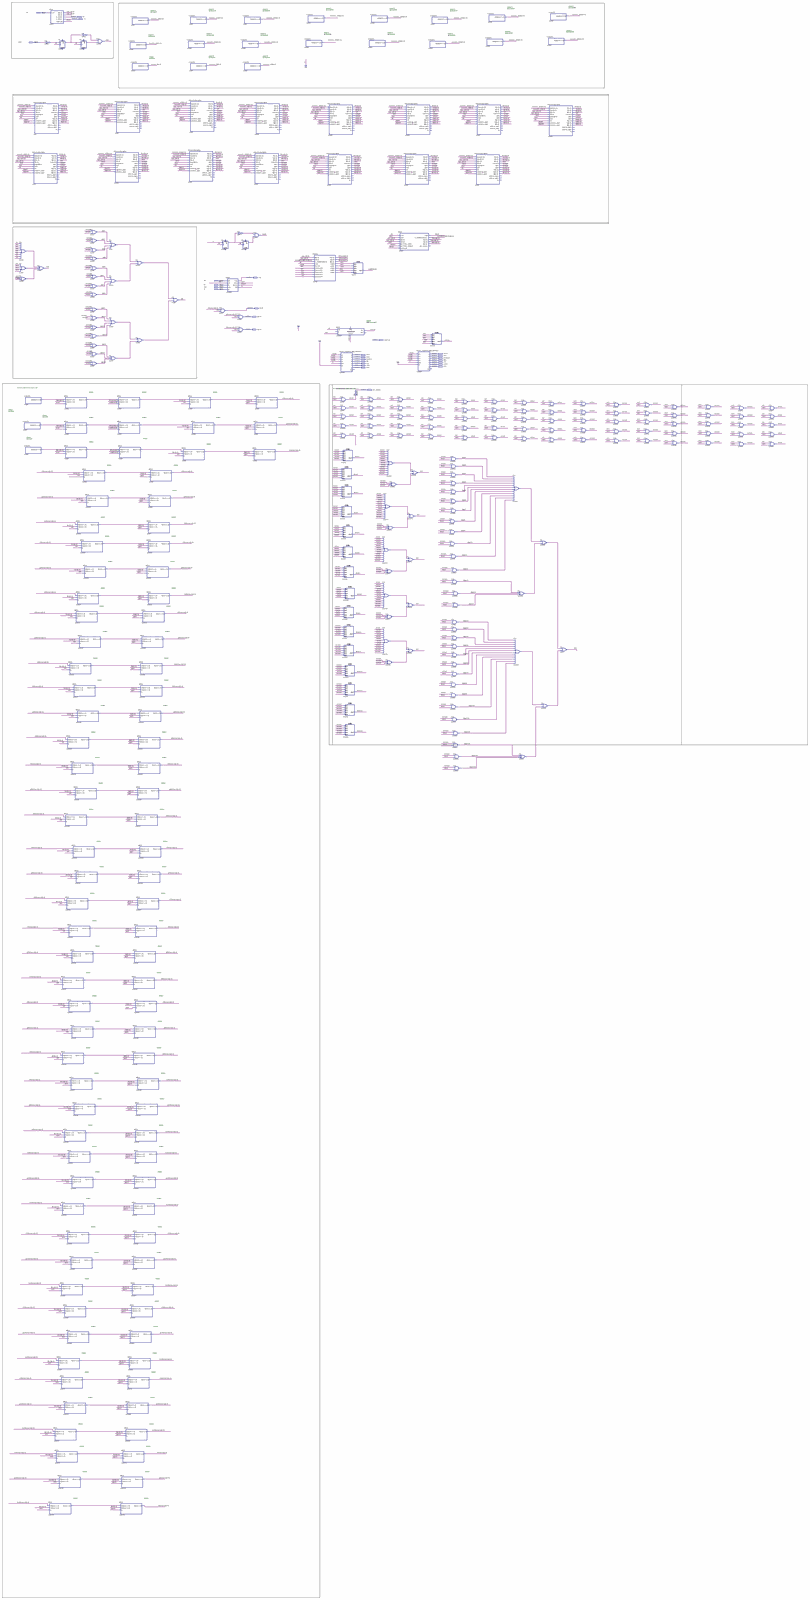
[diagram p0: schematic sheet, whole]
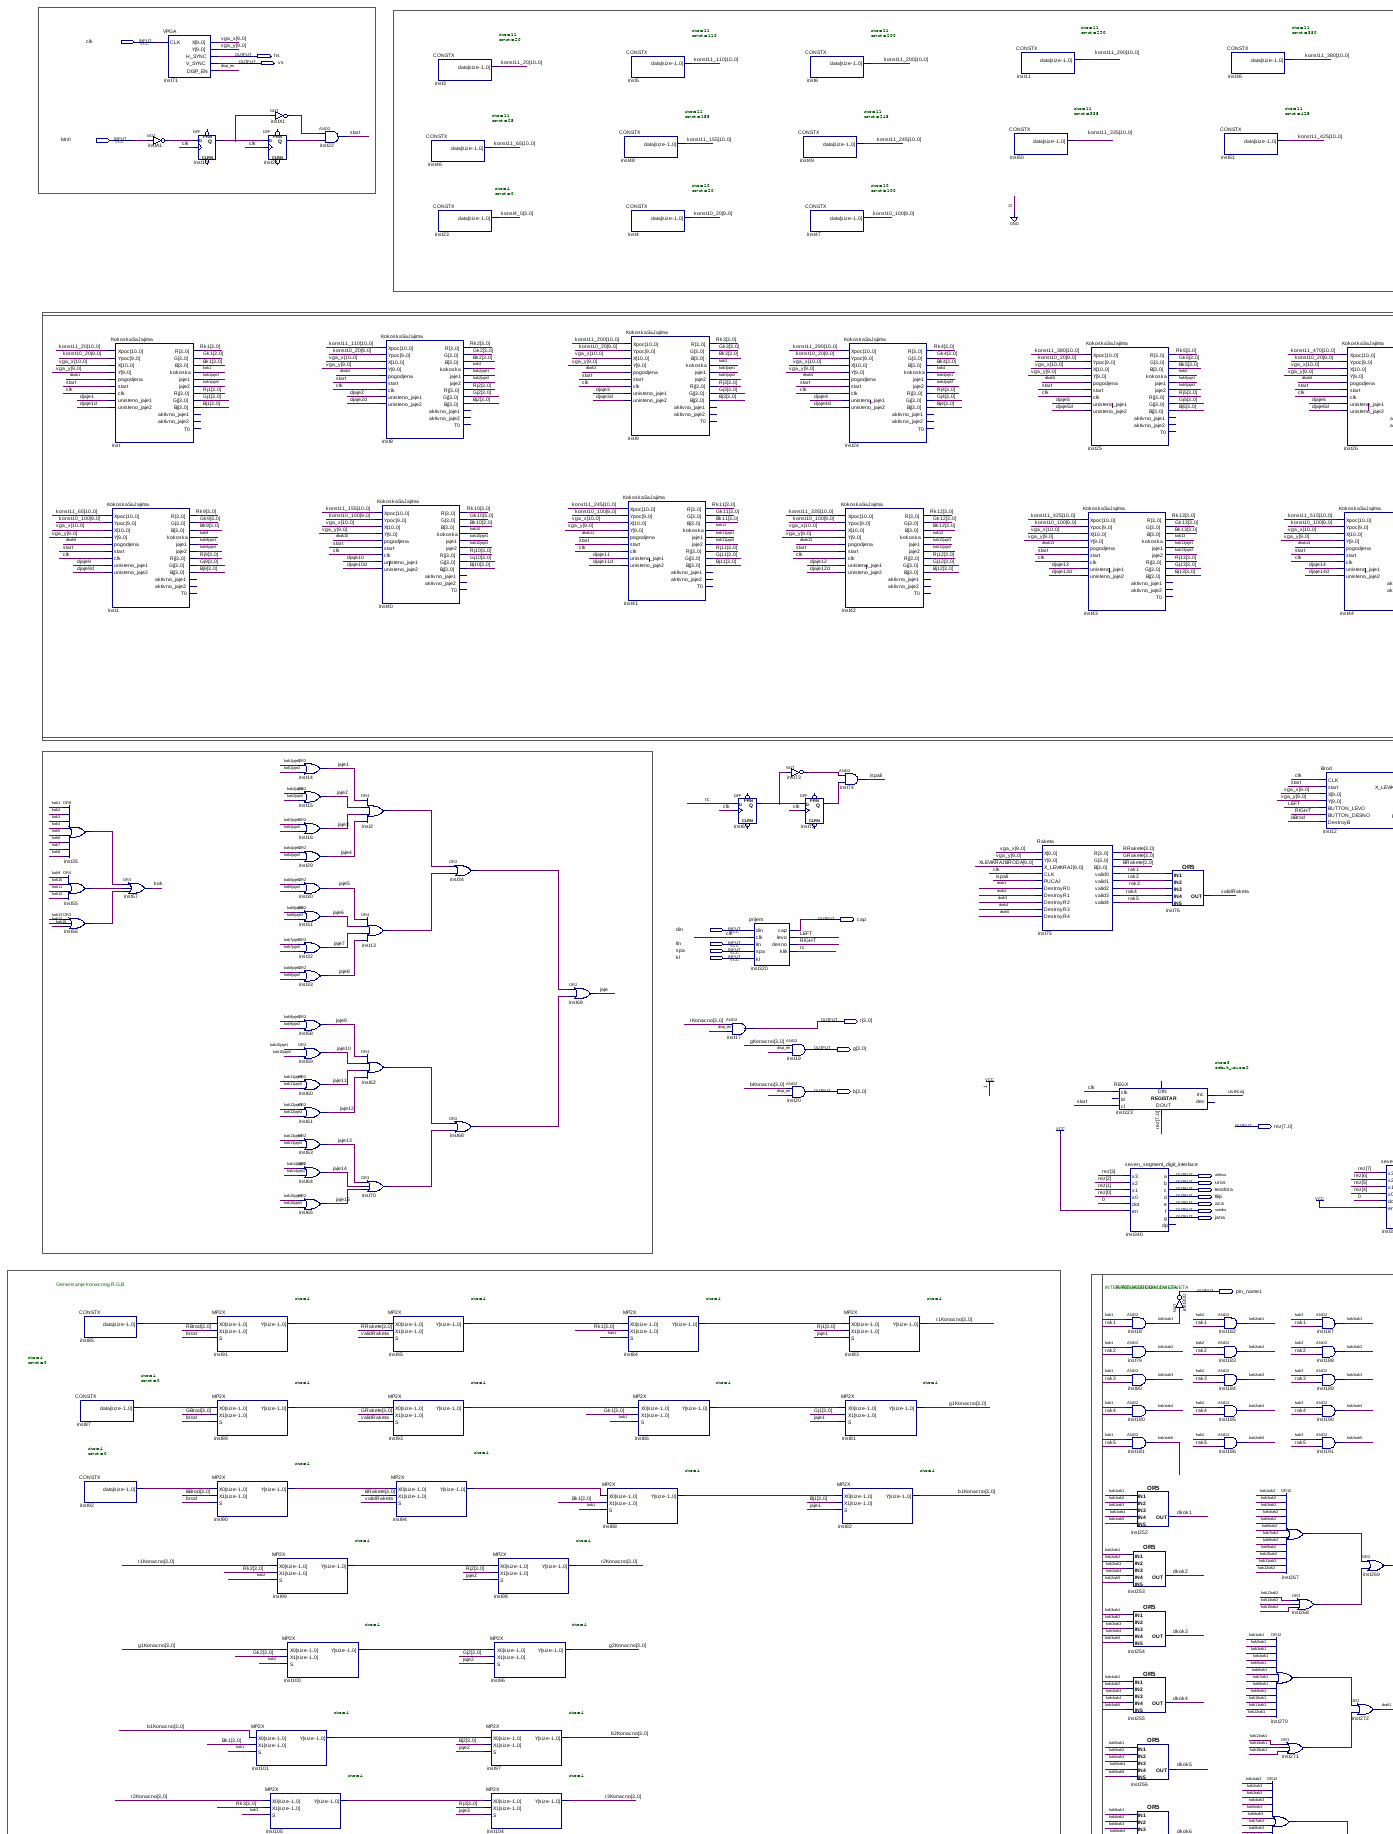
[diagram p1: schematic sheet, upper left part]
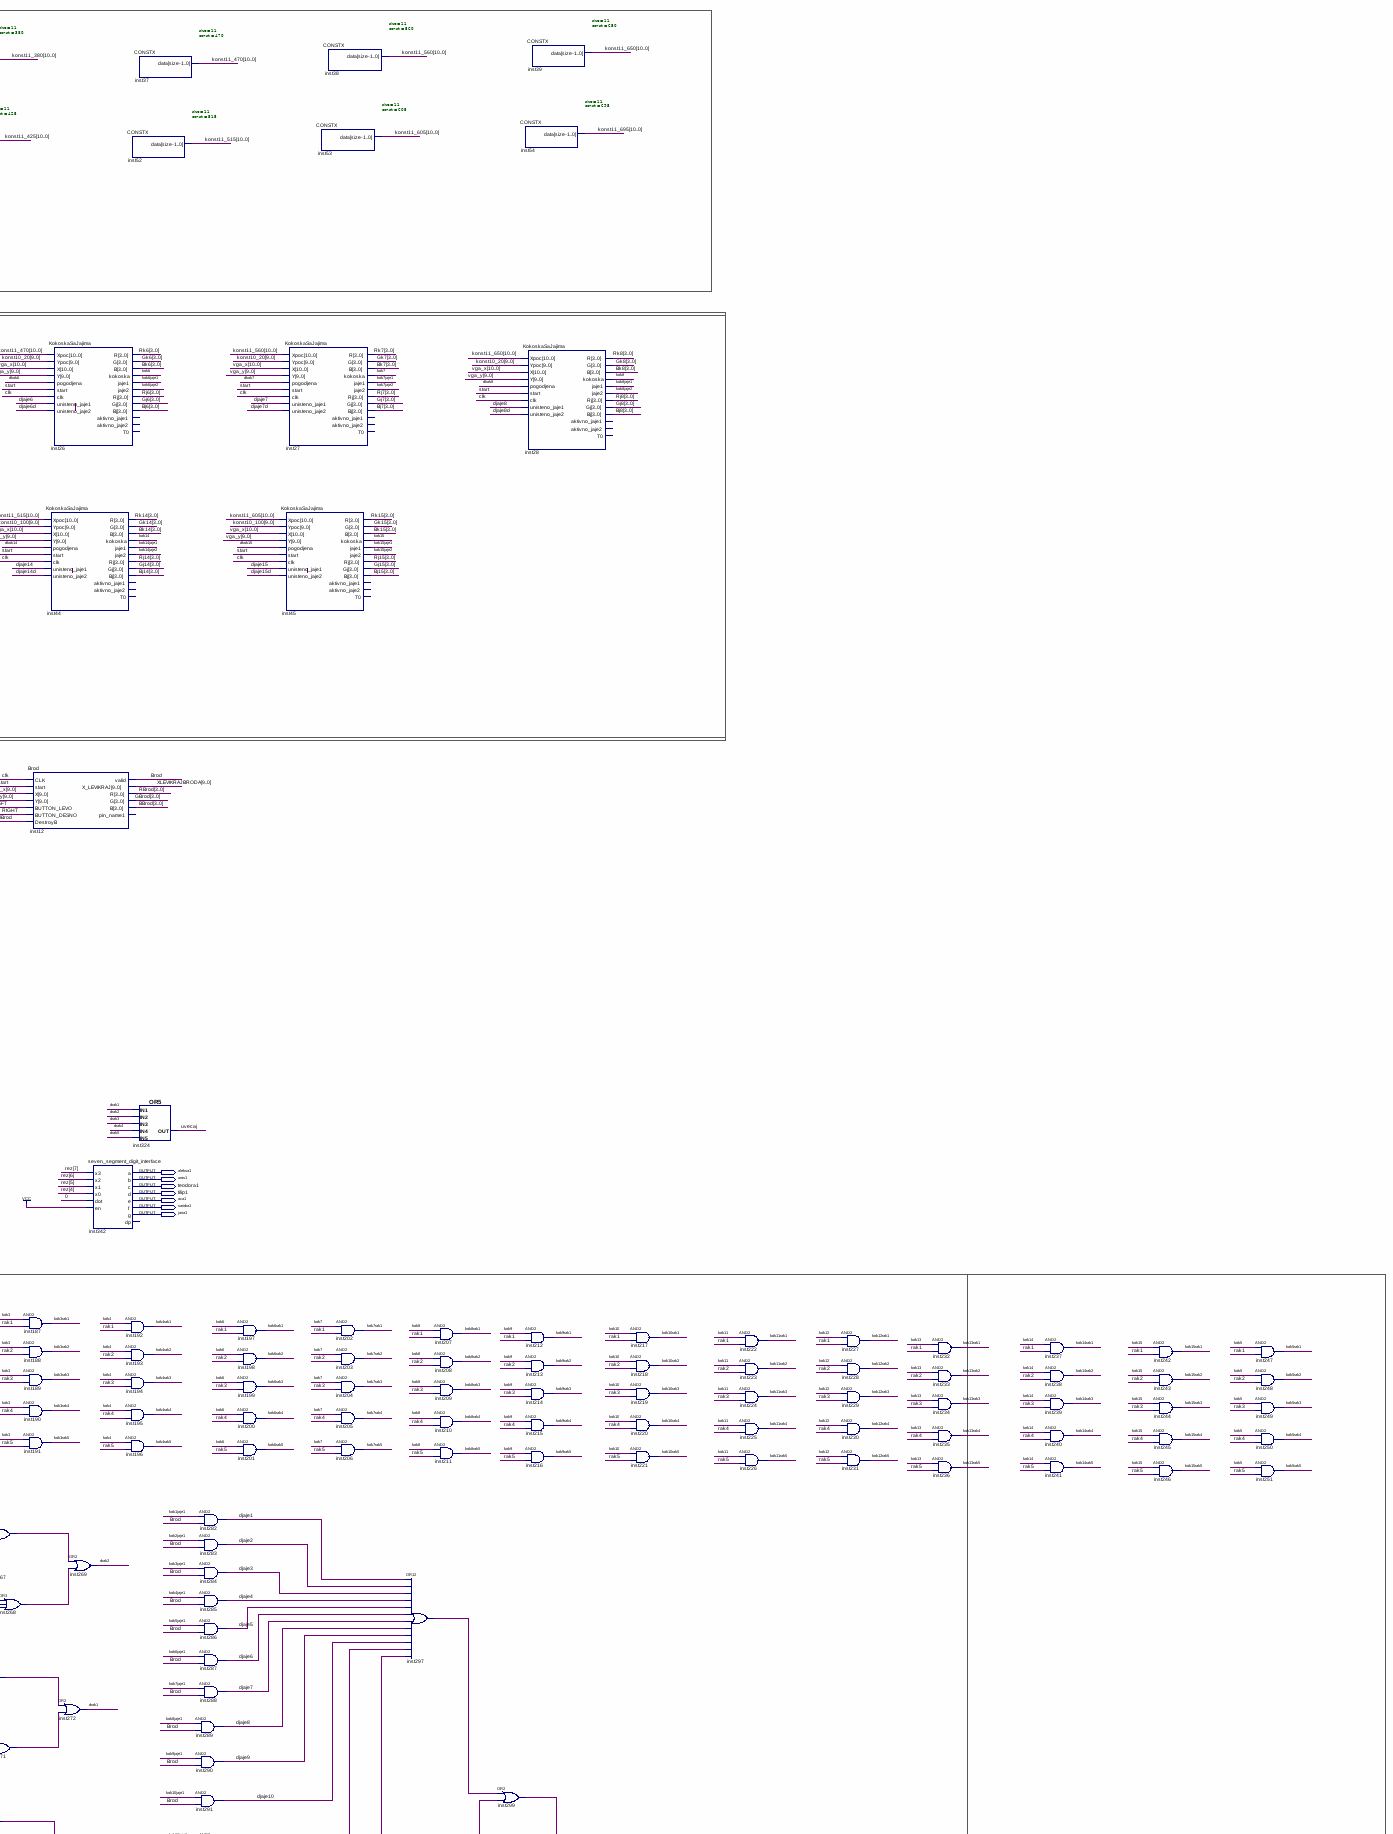
[diagram p2: schematic sheet, upper right part]
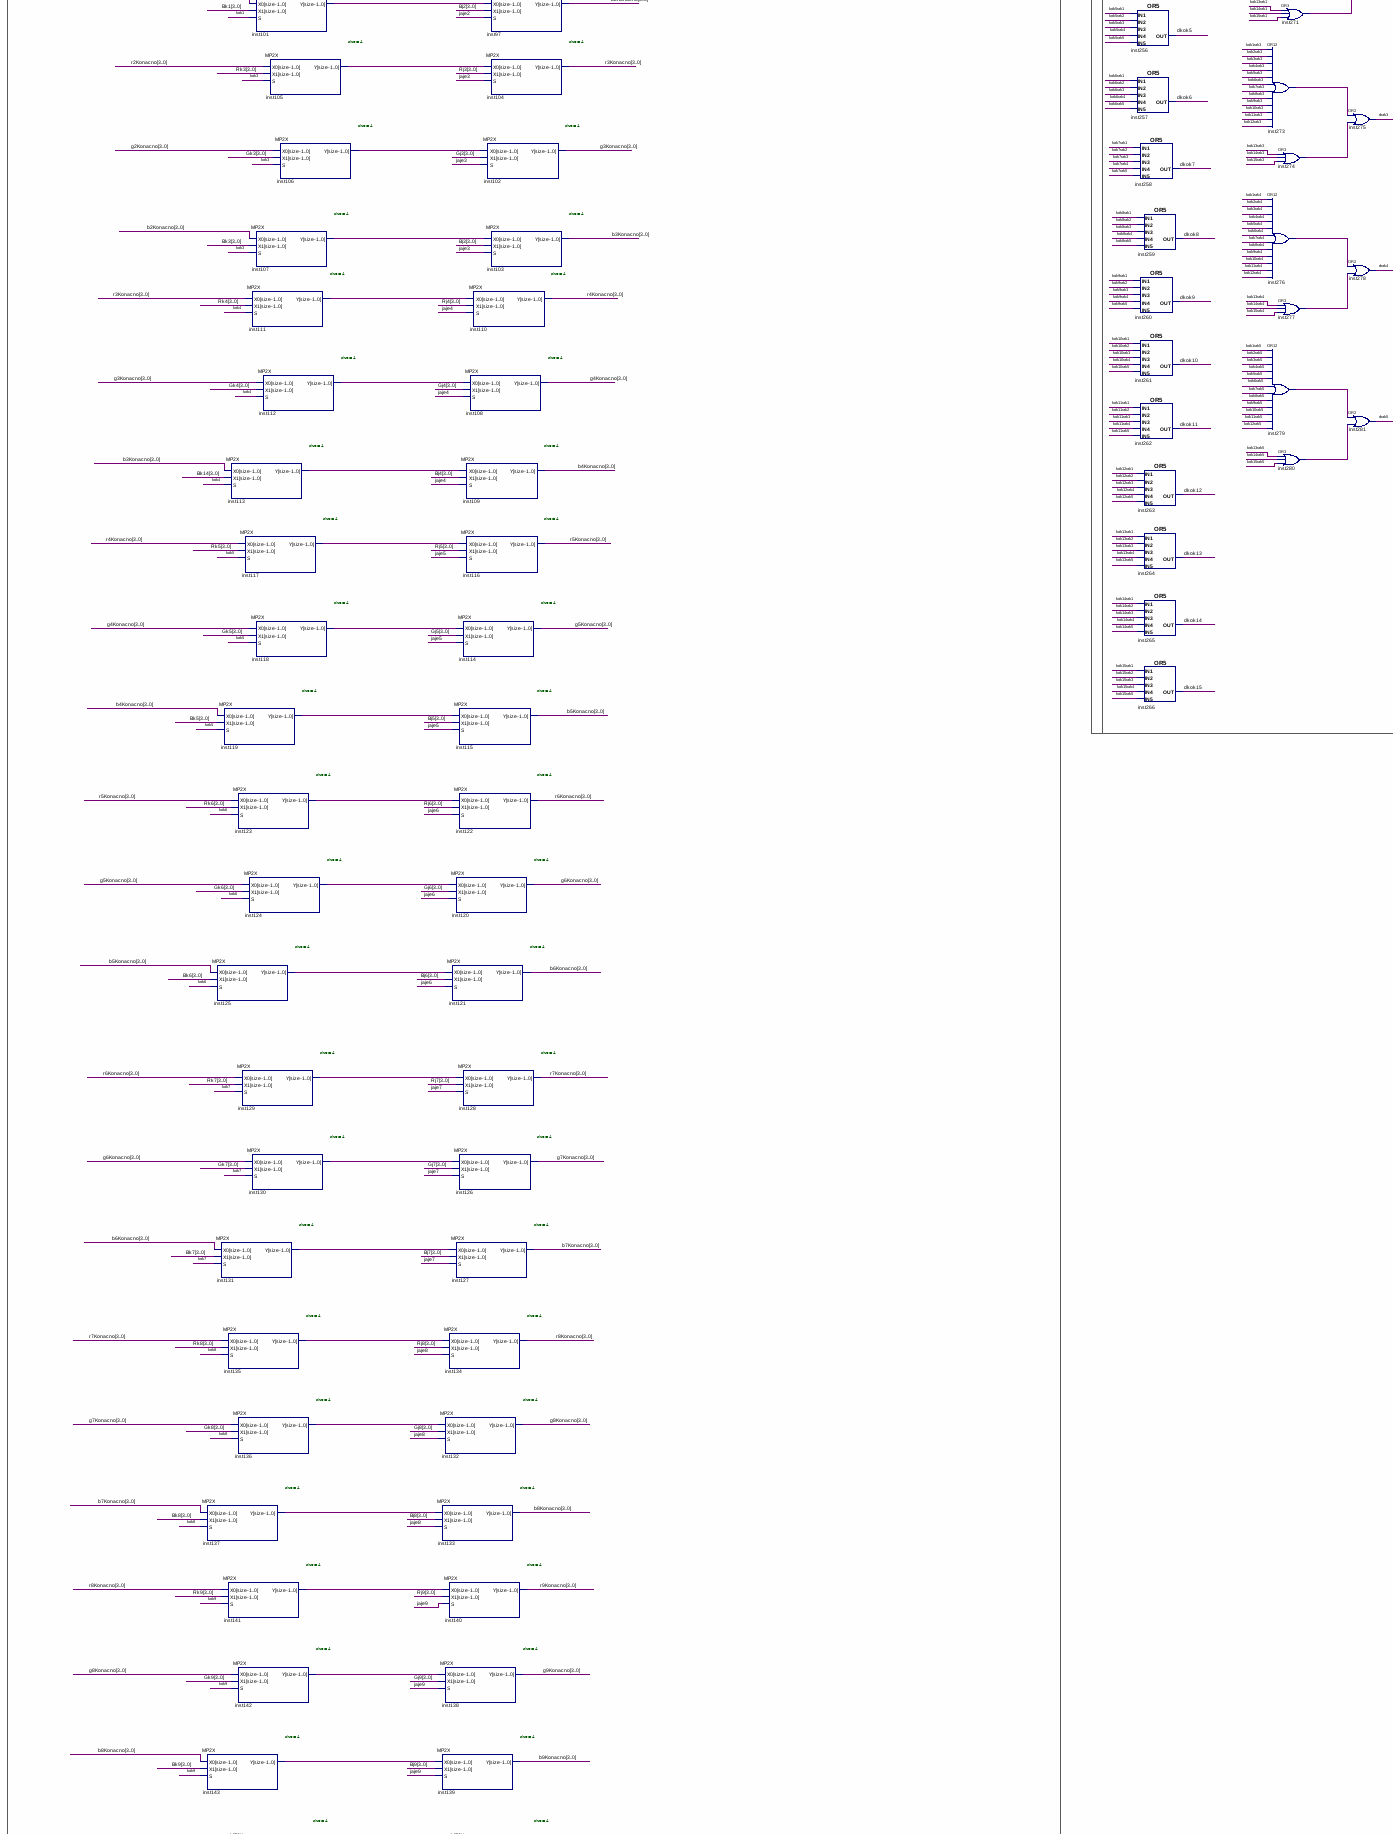
[diagram p3: schematic sheet, middle left part]
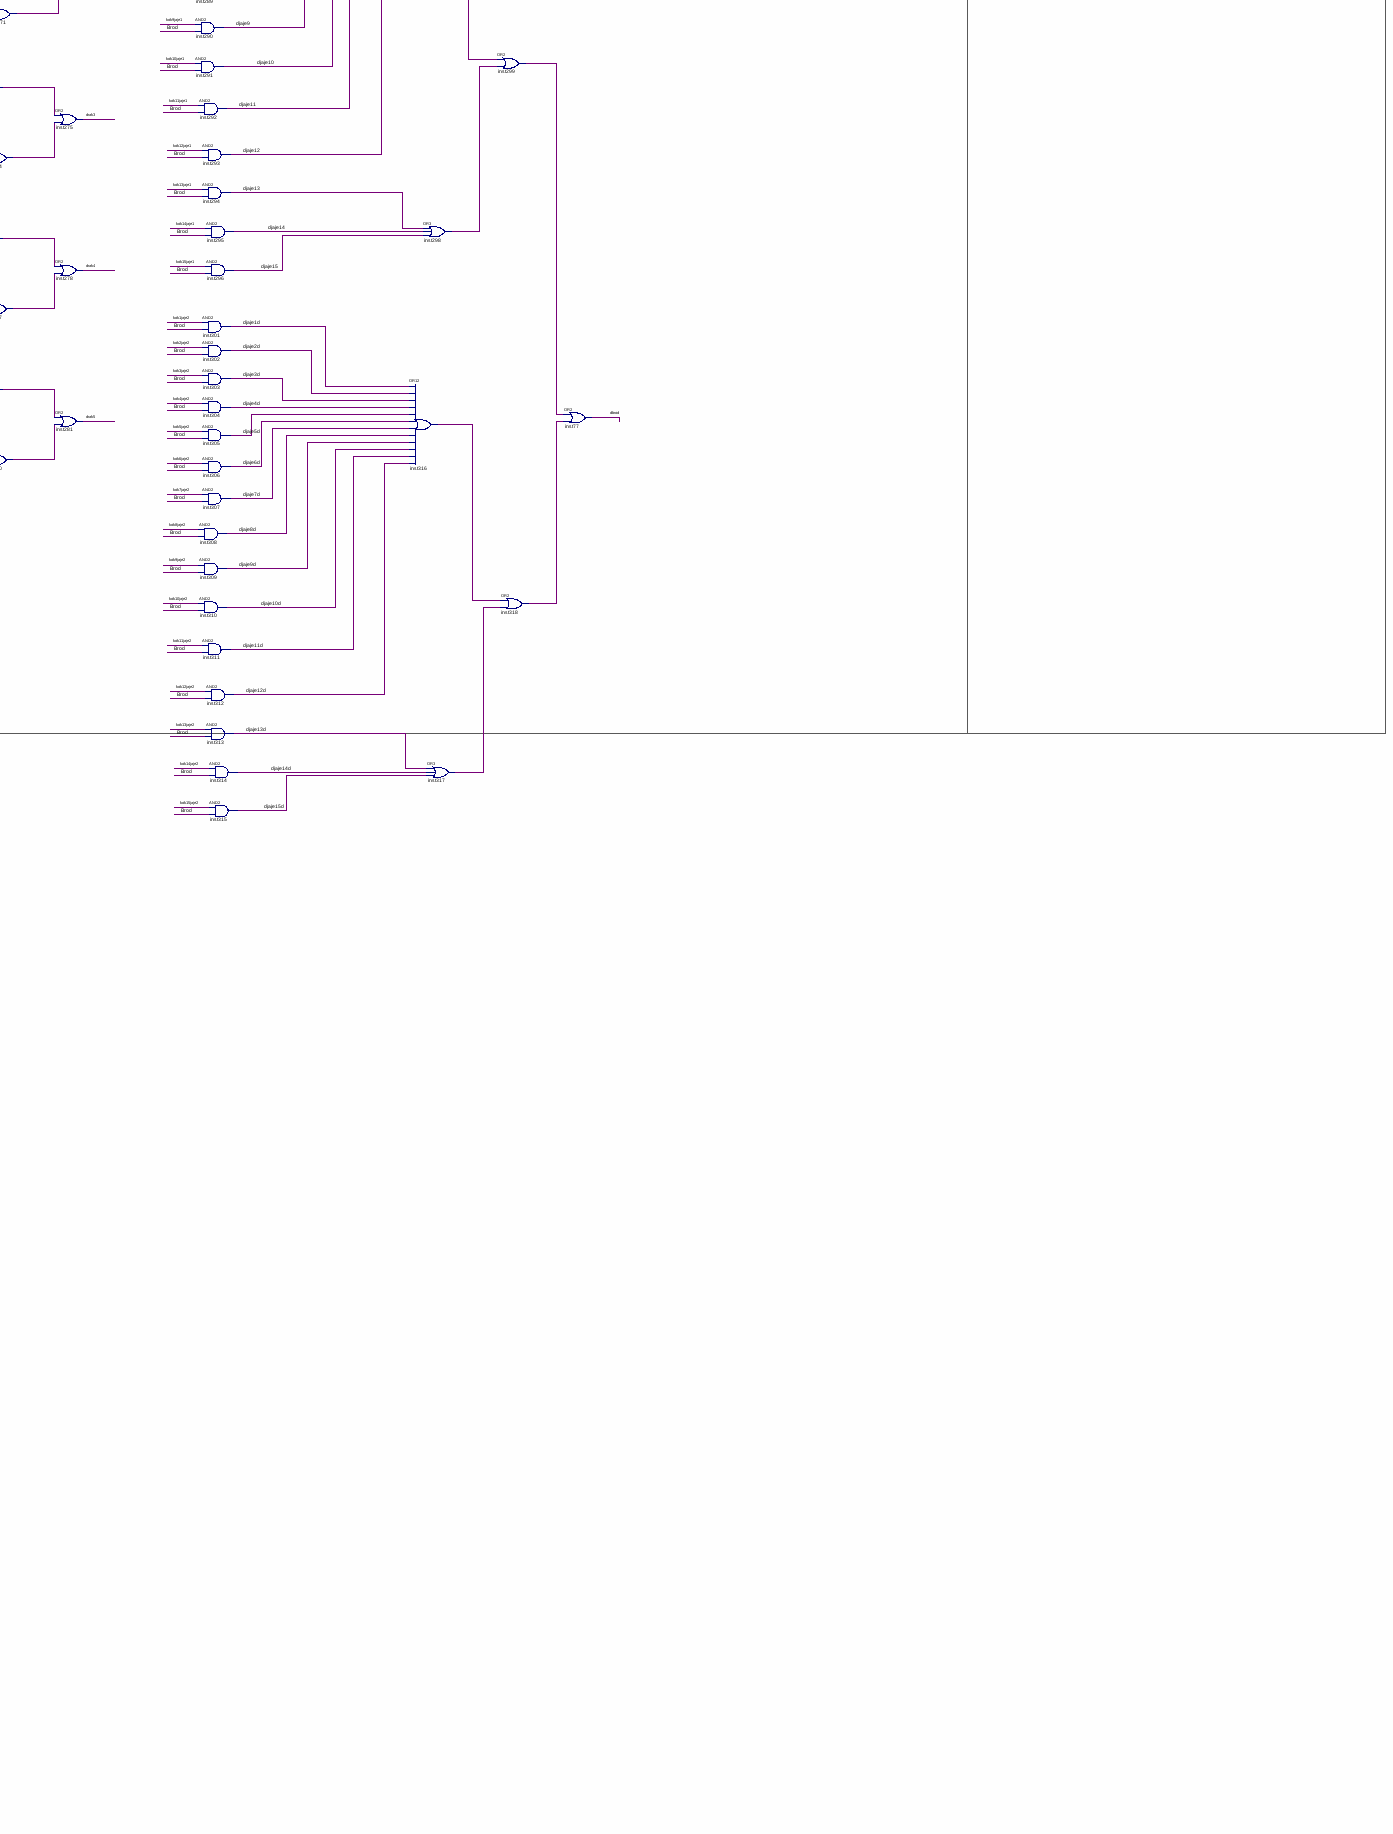
[diagram p4: schematic sheet, middle right part]
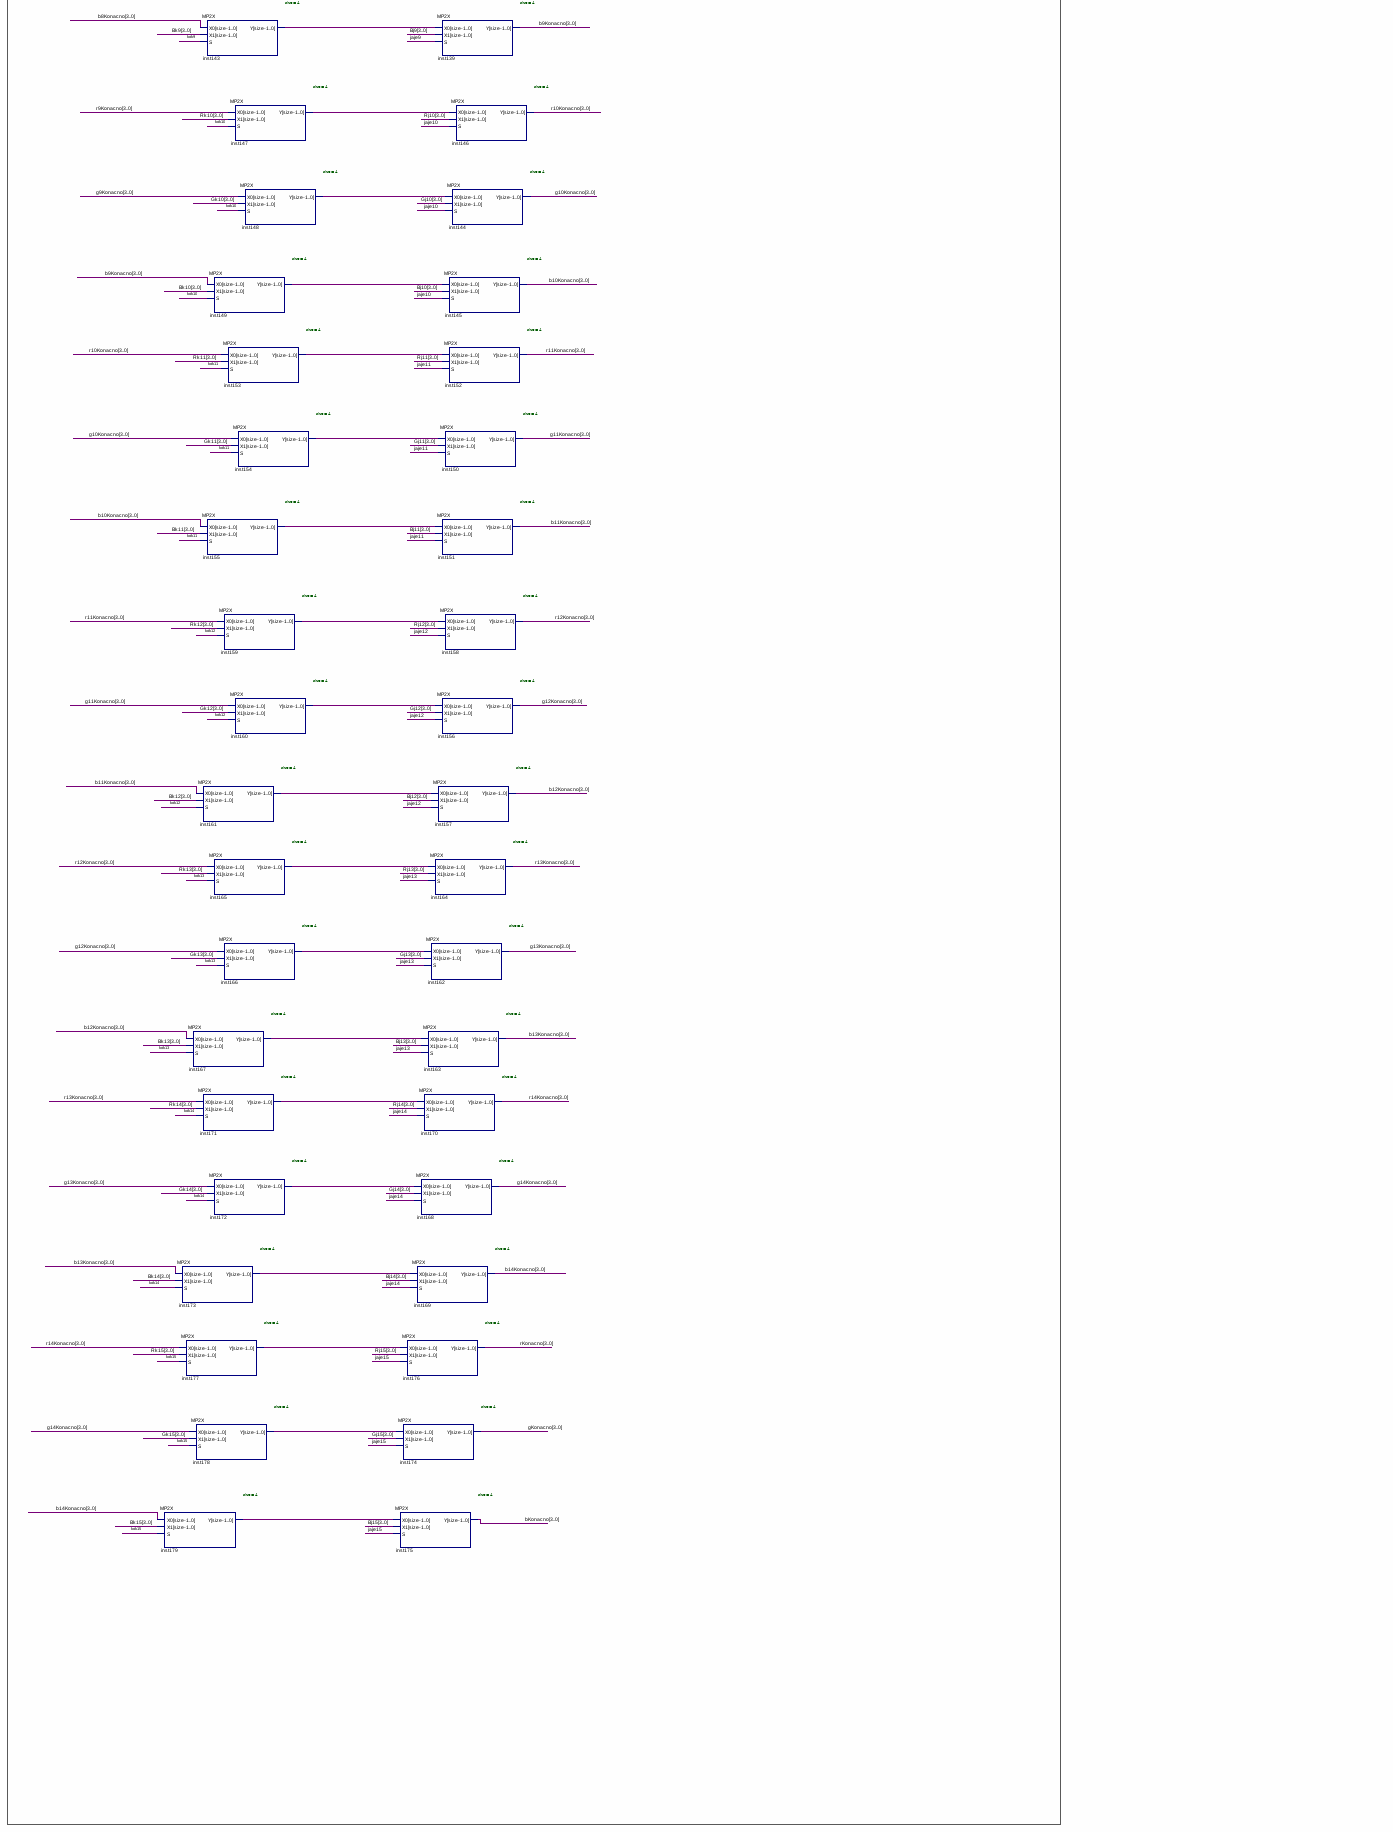
[diagram p5: schematic sheet, lower left part]
// Quartus schematic main.bdf as structural Verilog: 323 symbols, 28 pins
module main (
  input  clk,
  input  btn0,
  input  din,
  input  lin,
  input  spa,
  input  kl,
  output hs,
  output vs,
  output cap,
  output [3:0] r,
  output [3:0] g,
  output [3:0] b,
  output [7:0] rez,
  output aleksa1,
  output aleksa,
  output uros1,
  output uros,
  output teodora1,
  output teodora,
  output filip1,
  output filip,
  output aca1,
  output aca,
  output sandra1,
  output sandra,
  output jana1,
  output jana,
  output pin_name1
);

  wire brod, dBrod, disp_en, djaje1, djaje1d, djaje2, djaje2d, djaje3, djaje3d, djaje4, djaje4d, djaje5,
       djaje5d, djaje6, djaje6d, djaje7, djaje7d, djaje8, djaje8d, djaje9, djaje9d, djaje10, djaje10d,
       djaje11, djaje11d, djaje12, djaje12d, djaje13, djaje13d, djaje14, djaje14d, djaje15, djaje15d, dkok1,
       dkok2, dkok3, dkok4, dkok5, dkok6, dkok7, dkok8, dkok9, dkok10, dkok11, dkok12, dkok13, dkok14,
       dkok15, drak1, drak2, drak3, drak4, drak5, inst2_out, inst10_q, inst13_out, inst21_q, inst34_out,
       inst35_out, inst55_out, inst56_out, inst62_out, inst67_q, inst68_out, inst70_out, inst72_q,
       inst73_out, inst267_out, inst268_out, inst270_out, inst271_out, inst273_out, inst274_out, inst276_out,
       inst277_out, inst279_out, inst280_out, inst297_out, inst298_out, inst299_out, inst316_out,
       inst317_out, inst318_out, instA1_out, instX1_out, ispali, jaje, jaje1, jaje2, jaje3, jaje4, jaje5,
       jaje6, jaje7, jaje8, jaje9, jaje10, jaje11, jaje12, jaje13, jaje14, jaje15, kok, kok1, kok1jaje1,
       kok1jaje2, kok1rak1, kok1rak2, kok1rak3, kok1rak4, kok1rak5, kok2, kok2jaje1, kok2jaje2, kok2rak1,
       kok2rak2, kok2rak3, kok2rak4, kok2rak5, kok3, kok3jaje1, kok3jaje2, kok3rak1, kok3rak2, kok3rak3,
       kok3rak4, kok3rak5, kok4, kok4jaje1, kok4jaje2, kok4rak1, kok4rak2, kok4rak3, kok4rak4, kok4rak5,
       kok5, kok5jaje1, kok5jaje2, kok5rak1, kok5rak2, kok5rak3, kok5rak4, kok5rak5, kok6, kok6jaje1,
       kok6jaje2, kok6rak1, kok6rak2, kok6rak3, kok6rak4, kok6rak5, kok7, kok7jaje1, kok7jaje2, kok7rak1,
       kok7rak2, kok7rak3, kok7rak4, kok7rak5, kok8, kok8jaje1, kok8jaje2, kok8rak1, kok8rak2, kok8rak3,
       kok8rak4, kok8rak5, kok9, kok9jaje1, kok9jaje2, kok9rak1, kok9rak2, kok9rak3, kok9rak4, kok9rak5,
       kok10, kok10jaje1, kok10jaje2, kok10rak1, kok10rak2, kok10rak3, kok10rak4, kok10rak5, kok11,
       kok11jaje1, kok11jaje2, kok11rak1, kok11rak2, kok11rak3, kok11rak4, kok11rak5, kok12, kok12jaje1,
       kok12jaje2, kok12rak1, kok12rak2, kok12rak3, kok12rak4, kok12rak5, kok13, kok13jaje1, kok13jaje2,
       kok13rak1, kok13rak2, kok13rak3, kok13rak4, kok13rak5, kok14, kok14jaje1, kok14jaje2, kok14rak1,
       kok14rak2, kok14rak3, kok14rak4, kok14rak5, kok15, kok15jaje1, kok15jaje2, kok15rak1, kok15rak2,
       kok15rak3, kok15rak4, kok15rak5, LEFT, rak1, rak2, rak3, rak4, rak5, rc, RIGHT, start, uvecaj,
       validRaketa;
  wire [3:0] b1Konacno, b2Konacno, b3Konacno, b4Konacno, b5Konacno, b6Konacno, b7Konacno, b8Konacno,
       b9Konacno, b10Konacno, b11Konacno, b12Konacno, b13Konacno, b14Konacno, BBrod, Bj1, Bj2, Bj3, Bj4, Bj5,
       Bj6, Bj7, Bj8, Bj9, Bj10, Bj11, Bj12, Bj13, Bj14, Bj15, Bk1, Bk2, Bk3, Bk4, Bk5, Bk6, Bk7, Bk8, Bk9,
       Bk10, Bk11, Bk12, Bk13, Bk14, Bk15, bKonacno, BRakete, g1Konacno, g2Konacno, g3Konacno, g4Konacno,
       g5Konacno, g6Konacno, g7Konacno, g8Konacno, g9Konacno, g10Konacno, g11Konacno, g12Konacno, g13Konacno,
       g14Konacno, GBrod, Gj1, Gj2, Gj3, Gj4, Gj5, Gj6, Gj7, Gj8, Gj9, Gj10, Gj11, Gj12, Gj13, Gj14, Gj15,
       Gk1, Gk2, Gk3, Gk4, Gk5, Gk6, Gk7, Gk8, Gk9, Gk10, Gk11, Gk12, Gk13, Gk14, Gk15, gKonacno, GRakete,
       inst84_y, inst85_data, inst86_y, inst87_data, inst88_y, inst89_y, inst90_y, inst91_y, inst92_data,
       inst93_y, inst94_y, inst95_y, inst99_y, inst100_y, inst101_y, inst105_y, inst106_y, inst107_y,
       inst111_y, inst112_y, inst113_y, inst117_y, inst118_y, inst119_y, inst123_y, inst124_y, inst125_y,
       inst129_y, inst130_y, inst131_y, inst135_y, inst136_y, inst137_y, inst141_y, inst142_y, inst143_y,
       inst147_y, inst148_y, inst149_y, inst153_y, inst154_y, inst155_y, inst159_y, inst160_y, inst161_y,
       inst165_y, inst166_y, inst167_y, inst171_y, inst172_y, inst173_y, inst177_y, inst178_y, inst179_y,
       konst4_0, r1Konacno, r2Konacno, r3Konacno, r4Konacno, r5Konacno, r6Konacno, r7Konacno, r8Konacno,
       r9Konacno, r10Konacno, r11Konacno, r12Konacno, r13Konacno, r14Konacno, RBrod, Rj1, Rj2, Rj3, Rj4, Rj5,
       Rj6, Rj7, Rj8, Rj9, Rj10, Rj11, Rj12, Rj13, Rj14, Rj15, Rk1, Rk2, Rk3, Rk4, Rk5, Rk6, Rk7, Rk8, Rk9,
       Rk10, Rk11, Rk12, Rk13, Rk14, Rk15, rKonacno, RRakete;
  wire [9:0] konst10_20, konst10_100, vga_y, XLEVIKRAJBRODA;
  wire [10:0] konst11_20, konst11_65, konst11_110, konst11_155, konst11_200, konst11_245, konst11_290,
       konst11_335, konst11_380, konst11_425, konst11_470, konst11_515, konst11_560, konst11_605,
       konst11_650, konst11_695, vga_x;

  or inst35 (inst35_out, kok1, kok2, kok3, kok4, kok5, kok6, kok7, kok8);
  or inst55 (inst55_out, kok9, kok10, kok11, kok12);
  or inst56 (inst56_out, kok13, kok14, kok15);
  CONSTX #(.size(4), .\const (0)) inst87 (.data(inst87_data));
  CONSTX #(.size(4), .\const (0)) inst85 (.data(inst85_data));
  CONSTX #(.size(4), .\const (0)) inst92 (.data(inst92_data));
  KokoskaSaJajima inst (
    .Xpoc(konst11_20), .Ypoc(konst10_20), .X(vga_x), .Y(vga_y), .pogodjena(dkok1), .start(start), .clk(clk),
    .unisteno_jaje1(djaje1), .unisteno_jaje2(djaje1d), .R(Rk1), .G(Gk1), .B(Bk1), .kokoska(kok1),
    .jaje1(kok1jaje1), .jaje2(kok1jaje2), .Rj(Rj1), .Gj(Gj1), .Bj(Bj1));  // open: aktivno_jaje1, aktivno_jaje2, T0
  KokoskaSaJajima inst1 (
    .Xpoc(konst11_65), .Ypoc(konst10_100), .X(vga_x), .Y(vga_y), .pogodjena(dkok9), .start(start), .clk(clk),
    .unisteno_jaje1(djaje9), .unisteno_jaje2(djaje9d), .R(Rk9), .G(Gk9), .B(Bk9), .kokoska(kok9),
    .jaje1(kok9jaje1), .jaje2(kok9jaje2), .Rj(Rj9), .Gj(Gj9), .Bj(Bj9));  // open: aktivno_jaje1, aktivno_jaje2, T0
  or inst57 (kok, inst35_out, inst55_out, inst56_out);
  not instA1 (instA1_out, btn0);
  MP2X #(.size(4)) inst179 (.X0(b14Konacno), .X1(Bk15), .S(kok15), .Y(inst179_y));
  VPGA inst71 (.CLK(clk), .X(vga_x[9:0]), .Y(vga_y), .H_SYNC(hs), .V_SYNC(vs), .DISP_EN(disp_en));
  MP2X #(.size(4)) inst167 (.X0(b12Konacno), .X1(Bk13), .S(kok13), .Y(inst167_y));
  MP2X #(.size(4)) inst173 (.X0(b13Konacno), .X1(Bk14), .S(kok14), .Y(inst173_y));
  MP2X #(.size(4)) inst177 (.X0(r14Konacno), .X1(Rk15), .S(kok15), .Y(inst177_y));
  DFF inst10 (.CLK(clk), .D(instA1_out), .Q(inst10_q));  // open: CLRN, PRN
  MP2X #(.size(4)) inst91 (.X0(inst85_data), .X1(RBrod), .S(brod), .Y(inst91_y));
  MP2X #(.size(4)) inst89 (.X0(inst87_data), .X1(GBrod), .S(brod), .Y(inst89_y));
  MP2X #(.size(4)) inst90 (.X0(inst92_data), .X1(BBrod), .S(brod), .Y(inst90_y));
  MP2X #(.size(4)) inst125 (.X0(b5Konacno), .X1(Bk6), .S(kok6), .Y(inst125_y));
  MP2X #(.size(4)) inst131 (.X0(b6Konacno), .X1(Bk7), .S(kok7), .Y(inst131_y));
  MP2X #(.size(4)) inst137 (.X0(b7Konacno), .X1(Bk8), .S(kok8), .Y(inst137_y));
  MP2X #(.size(4)) inst143 (.X0(b8Konacno), .X1(Bk9), .S(kok9), .Y(inst143_y));
  MP2X #(.size(4)) inst149 (.X0(b9Konacno), .X1(Bk10), .S(kok10), .Y(inst149_y));
  MP2X #(.size(4)) inst155 (.X0(b10Konacno), .X1(Bk11), .S(kok11), .Y(inst155_y));
  MP2X #(.size(4)) inst161 (.X0(b11Konacno), .X1(Bk12), .S(kok12), .Y(inst161_y));
  MP2X #(.size(4)) inst165 (.X0(r12Konacno), .X1(Rk13), .S(kok13), .Y(inst165_y));
  MP2X #(.size(4)) inst171 (.X0(r13Konacno), .X1(Rk14), .S(kok14), .Y(inst171_y));
  MP2X #(.size(4)) inst172 (.X0(g13Konacno), .X1(Gk14), .S(kok14), .Y(inst172_y));
  MP2X #(.size(4)) inst178 (.X0(g14Konacno), .X1(Gk15), .S(kok15), .Y(inst178_y));
  MP2X #(.size(4)) inst113 (.X0(b3Konacno), .X1(Bk14), .S(kok4), .Y(inst113_y));
  MP2X #(.size(4)) inst117 (.X0(r4Konacno), .X1(Rk5), .S(kok5), .Y(inst117_y));
  MP2X #(.size(4)) inst119 (.X0(b4Konacno), .X1(Bk5), .S(kok5), .Y(inst119_y));
  MP2X #(.size(4)) inst123 (.X0(r5Konacno), .X1(Rk6), .S(kok6), .Y(inst123_y));
  MP2X #(.size(4)) inst124 (.X0(g5Konacno), .X1(Gk6), .S(kok6), .Y(inst124_y));
  MP2X #(.size(4)) inst129 (.X0(r6Konacno), .X1(Rk7), .S(kok7), .Y(inst129_y));
  MP2X #(.size(4)) inst135 (.X0(r7Konacno), .X1(Rk8), .S(kok8), .Y(inst135_y));
  MP2X #(.size(4)) inst136 (.X0(g7Konacno), .X1(Gk8), .S(kok8), .Y(inst136_y));
  MP2X #(.size(4)) inst141 (.X0(r8Konacno), .X1(Rk9), .S(kok9), .Y(inst141_y));
  MP2X #(.size(4)) inst142 (.X0(g8Konacno), .X1(Gk9), .S(kok9), .Y(inst142_y));
  MP2X #(.size(4)) inst147 (.X0(r9Konacno), .X1(Rk10), .S(kok10), .Y(inst147_y));
  MP2X #(.size(4)) inst148 (.X0(g9Konacno), .X1(Gk10), .S(kok10), .Y(inst148_y));
  MP2X #(.size(4)) inst153 (.X0(r10Konacno), .X1(Rk11), .S(kok11), .Y(inst153_y));
  MP2X #(.size(4)) inst154 (.X0(g10Konacno), .X1(Gk11), .S(kok11), .Y(inst154_y));
  MP2X #(.size(4)) inst159 (.X0(r11Konacno), .X1(Rk12), .S(kok12), .Y(inst159_y));
  MP2X #(.size(4)) inst160 (.X0(g11Konacno), .X1(Gk12), .S(kok12), .Y(inst160_y));
  MP2X #(.size(4)) inst166 (.X0(g12Konacno), .X1(Gk13), .S(kok13), .Y(inst166_y));
  not instX1 (instX1_out, inst10_q);
  DFF inst21 (.CLK(clk), .D(inst10_q), .Q(inst21_q));  // open: CLRN, PRN
  MP2X #(.size(4)) inst99 (.X0(r1Konacno), .X1(Rk2), .S(kok2), .Y(inst99_y));
  MP2X #(.size(4)) inst101 (.X0(b1Konacno), .X1(Bk1), .S(kok1), .Y(inst101_y));
  MP2X #(.size(4)) inst105 (.X0(r2Konacno), .X1(Rk3), .S(kok3), .Y(inst105_y));
  MP2X #(.size(4)) inst107 (.X0(b2Konacno), .X1(Bk3), .S(kok3), .Y(inst107_y));
  MP2X #(.size(4)) inst111 (.X0(r3Konacno), .X1(Rk4), .S(kok4), .Y(inst111_y));
  MP2X #(.size(4)) inst112 (.X0(g3Konacno), .X1(Gk4), .S(kok4), .Y(inst112_y));
  MP2X #(.size(4)) inst118 (.X0(g4Konacno), .X1(Gk5), .S(kok5), .Y(inst118_y));
  MP2X #(.size(4)) inst130 (.X0(g6Konacno), .X1(Gk7), .S(kok7), .Y(inst130_y));
  or inst14 (jaje1, kok1jaje1, kok1jaje2);
  or inst15 (jaje2, kok2jaje1, kok2jaje2);
  or inst16 (jaje3, kok3jaje1, kok3jaje2);
  or inst29 (jaje4, kok4jaje1, kok4jaje2);
  or inst30 (jaje5, kok5jaje1, kok5jaje2);
  or inst31 (jaje6, kok6jaje1, kok6jaje2);
  or inst32 (jaje7, kok7jaje1, kok7jaje2);
  or inst33 (jaje8, kok8jaje1, kok8jaje2);
  or inst58 (jaje9, kok9jaje1, kok9jaje2);
  or inst59 (jaje10, kok10jaje1, kok10jaje2);
  or inst60 (jaje11, kok11jaje1, kok11jaje2);
  or inst61 (jaje12, kok12jaje1, kok12jaje2);
  or inst63 (jaje13, kok13jaje1, kok13jaje2);
  or inst64 (jaje14, kok14jaje1, kok14jaje2);
  or inst65 (jaje15, kok15jaje1, kok15jaje2);
  MP2X #(.size(4)) inst100 (.X0(g1Konacno), .X1(Gk2), .S(kok2), .Y(inst100_y));
  MP2X #(.size(4)) inst106 (.X0(g2Konacno), .X1(Gk3), .S(kok3), .Y(inst106_y));
  and inst22 (start, instX1_out, inst21_q);
  KokoskaSaJajima inst8 (
    .Xpoc(konst11_110), .Ypoc(konst10_20), .X(vga_x), .Y(vga_y), .pogodjena(dkok2), .start(start), .clk(clk),
    .unisteno_jaje1(djaje2), .unisteno_jaje2(djaje2d), .R(Rk2), .G(Gk2), .B(Bk2), .kokoska(kok2),
    .jaje1(kok2jaje1), .jaje2(kok2jaje2), .Rj(Rj2), .Gj(Gj2), .Bj(Bj2));  // open: aktivno_jaje1, aktivno_jaje2, T0
  KokoskaSaJajima inst40 (
    .Xpoc(konst11_155), .Ypoc(konst10_100), .X(vga_x), .Y(vga_y), .pogodjena(dkok10), .start(start),
    .clk(clk), .unisteno_jaje1(djaje10), .unisteno_jaje2(djaje10d), .R(Rk10), .G(Gk10), .B(Bk10),
    .kokoska(kok10), .jaje1(kok10jaje1), .jaje2(kok10jaje2), .Rj(Rj10), .Gj(Gj10), .Bj(Bj10));  // open: aktivno_jaje1, aktivno_jaje2, T0
  or inst2 (inst2_out, jaje1, jaje2, jaje3, jaje4);
  or inst13 (inst13_out, jaje5, jaje6, jaje7, jaje8);
  or inst62 (inst62_out, jaje9, jaje10, jaje11, jaje12);
  or inst70 (inst70_out, jaje13, jaje14, jaje15);
  MP2X #(.size(4)) inst95 (.X0(inst91_y), .X1(RRakete), .S(validRaketa), .Y(inst95_y));
  MP2X #(.size(4)) inst93 (.X0(inst89_y), .X1(GRakete), .S(validRaketa), .Y(inst93_y));
  MP2X #(.size(4)) inst94 (.X0(inst90_y), .X1(BRakete), .S(validRaketa), .Y(inst94_y));
  MP2X #(.size(4)) inst169 (.X0(inst173_y), .X1(Bj14), .S(jaje14), .Y(b14Konacno));
  MP2X #(.size(4)) inst176 (.X0(inst177_y), .X1(Rj15), .S(jaje15), .Y(rKonacno));
  MP2X #(.size(4)) inst174 (.X0(inst178_y), .X1(Gj15), .S(jaje15), .Y(gKonacno));
  MP2X #(.size(4)) inst175 (.X0(inst179_y), .X1(Bj15), .S(jaje15), .Y(bKonacno));
  CONSTX #(.size(11), .\const (20)) inst3 (.data(konst11_20));
  CONSTX #(.size(11), .\const (65)) inst46 (.data(konst11_65));
  CONSTX #(.size(4), .\const (0)) inst23 (.data(konst4_0));
  MP2X #(.size(4)) inst132 (.X0(inst136_y), .X1(Gj8), .S(jaje8), .Y(g8Konacno));
  MP2X #(.size(4)) inst133 (.X0(inst137_y), .X1(Bj8), .S(jaje8), .Y(b8Konacno));
  MP2X #(.size(4)) inst138 (.X0(inst142_y), .X1(Gj9), .S(jaje9), .Y(g9Konacno));
  MP2X #(.size(4)) inst139 (.X0(inst143_y), .X1(Bj9), .S(jaje9), .Y(b9Konacno));
  MP2X #(.size(4)) inst150 (.X0(inst154_y), .X1(Gj11), .S(jaje11), .Y(g11Konacno));
  MP2X #(.size(4)) inst151 (.X0(inst155_y), .X1(Bj11), .S(jaje11), .Y(b11Konacno));
  MP2X #(.size(4)) inst158 (.X0(inst159_y), .X1(Rj12), .S(jaje12), .Y(r12Konacno));
  MP2X #(.size(4)) inst156 (.X0(inst160_y), .X1(Gj12), .S(jaje12), .Y(g12Konacno));
  MP2X #(.size(4)) inst157 (.X0(inst161_y), .X1(Bj12), .S(jaje12), .Y(b12Konacno));
  MP2X #(.size(4)) inst164 (.X0(inst165_y), .X1(Rj13), .S(jaje13), .Y(r13Konacno));
  MP2X #(.size(4)) inst162 (.X0(inst166_y), .X1(Gj13), .S(jaje13), .Y(g13Konacno));
  MP2X #(.size(4)) inst163 (.X0(inst167_y), .X1(Bj13), .S(jaje13), .Y(b13Konacno));
  MP2X #(.size(4)) inst170 (.X0(inst171_y), .X1(Rj14), .S(jaje14), .Y(r14Konacno));
  MP2X #(.size(4)) inst168 (.X0(inst172_y), .X1(Gj14), .S(jaje14), .Y(g14Konacno));
  or inst34 (inst34_out, inst2_out, inst13_out);
  or inst68 (inst68_out, inst62_out, inst70_out);
  MP2X #(.size(4)) inst110 (.X0(inst111_y), .X1(Rj4), .S(jaje4), .Y(r4Konacno));
  MP2X #(.size(4)) inst108 (.X0(inst112_y), .X1(Gj4), .S(jaje4), .Y(g4Konacno));
  MP2X #(.size(4)) inst109 (.X0(inst113_y), .X1(Bj4), .S(jaje4), .Y(b4Konacno));
  MP2X #(.size(4)) inst116 (.X0(inst117_y), .X1(Rj5), .S(jaje5), .Y(r5Konacno));
  MP2X #(.size(4)) inst114 (.X0(inst118_y), .X1(Gj5), .S(jaje5), .Y(g5Konacno));
  MP2X #(.size(4)) inst115 (.X0(inst119_y), .X1(Bj5), .S(jaje5), .Y(b5Konacno));
  MP2X #(.size(4)) inst122 (.X0(inst123_y), .X1(Rj6), .S(jaje6), .Y(r6Konacno));
  MP2X #(.size(4)) inst120 (.X0(inst124_y), .X1(Gj6), .S(jaje6), .Y(g6Konacno));
  MP2X #(.size(4)) inst121 (.X0(inst125_y), .X1(Bj6), .S(jaje6), .Y(b6Konacno));
  MP2X #(.size(4)) inst128 (.X0(inst129_y), .X1(Rj7), .S(jaje7), .Y(r7Konacno));
  MP2X #(.size(4)) inst126 (.X0(inst130_y), .X1(Gj7), .S(jaje7), .Y(g7Konacno));
  MP2X #(.size(4)) inst127 (.X0(inst131_y), .X1(Bj7), .S(jaje7), .Y(b7Konacno));
  MP2X #(.size(4)) inst134 (.X0(inst135_y), .X1(Rj8), .S(jaje8), .Y(r8Konacno));
  MP2X #(.size(4)) inst140 (.X0(inst141_y), .X1(Rj9), .S(jaje9), .Y(r9Konacno));
  MP2X #(.size(4)) inst146 (.X0(inst147_y), .X1(Rj10), .S(jaje10), .Y(r10Konacno));
  MP2X #(.size(4)) inst144 (.X0(inst148_y), .X1(Gj10), .S(jaje10), .Y(g10Konacno));
  MP2X #(.size(4)) inst145 (.X0(inst149_y), .X1(Bj10), .S(jaje10), .Y(b10Konacno));
  MP2X #(.size(4)) inst152 (.X0(inst153_y), .X1(Rj11), .S(jaje11), .Y(r11Konacno));
  MP2X #(.size(4)) inst98 (.X0(inst99_y), .X1(Rj2), .S(jaje2), .Y(r2Konacno));
  MP2X #(.size(4)) inst96 (.X0(inst100_y), .X1(Gj2), .S(jaje2), .Y(g2Konacno));
  MP2X #(.size(4)) inst97 (.X0(inst101_y), .X1(Bj2), .S(jaje2), .Y(b2Konacno));
  MP2X #(.size(4)) inst104 (.X0(inst105_y), .X1(Rj3), .S(jaje3), .Y(r3Konacno));
  MP2X #(.size(4)) inst102 (.X0(inst106_y), .X1(Gj3), .S(jaje3), .Y(g3Konacno));
  MP2X #(.size(4)) inst103 (.X0(inst107_y), .X1(Bj3), .S(jaje3), .Y(b3Konacno));
  or inst69 (jaje, inst34_out, inst68_out);
  MP2X #(.size(4)) inst88 (.X0(inst94_y), .X1(Bk1), .S(kok1), .Y(inst88_y));
  CONSTX #(.size(11), .\const (110)) inst5 (.data(konst11_110));
  CONSTX #(.size(11), .\const (155)) inst48 (.data(konst11_155));
  CONSTX #(.size(10), .\const (20)) inst4 (.data(konst10_20));
  KokoskaSaJajima inst9 (
    .Xpoc(konst11_200), .Ypoc(konst10_20), .X(vga_x), .Y(vga_y), .pogodjena(dkok3), .start(start), .clk(clk),
    .unisteno_jaje1(djaje3), .unisteno_jaje2(djaje3d), .R(Rk3), .G(Gk3), .B(Bk3), .kokoska(kok3),
    .jaje1(kok3jaje1), .jaje2(kok3jaje2), .Rj(Rj3), .Gj(Gj3), .Bj(Bj3));  // open: aktivno_jaje1, aktivno_jaje2, T0
  KokoskaSaJajima inst41 (
    .Xpoc(konst11_245), .Ypoc(konst10_100), .X(vga_x), .Y(vga_y), .pogodjena(dkok11), .start(start),
    .clk(clk), .unisteno_jaje1(djaje11), .unisteno_jaje2(djaje11d), .R(Rk11), .G(Gk11), .B(Bk11),
    .kokoska(kok11), .jaje1(kok11jaje1), .jaje2(kok11jaje2), .Rj(Rj11), .Gj(Gj11), .Bj(Bj11));  // open: aktivno_jaje1, aktivno_jaje2, T0
  MP2X #(.size(4)) inst84 (.X0(inst95_y), .X1(Rk1), .S(kok1), .Y(inst84_y));
  MP2X #(.size(4)) inst86 (.X0(inst93_y), .X1(Gk1), .S(kok1), .Y(inst86_y));
  DFF inst67 (.CLK(clk), .D(rc), .Q(inst67_q));  // open: CLRN, PRN
  prijem inst320 (
    .din(din), .clk(clk), .lin(lin), .spa(spa), .kl(kl), .cap(cap), .levo(LEFT), .desno(RIGHT), .klik(rc));
  assign r = rKonacno & {4{disp_en}};  // AND2 inst17, 4 bits wide
  CONSTX #(.size(11), .\const (200)) inst6 (.data(konst11_200));
  CONSTX #(.size(11), .\const (245)) inst49 (.data(konst11_245));
  CONSTX #(.size(10), .\const (100)) inst47 (.data(konst10_100));
  not inst73 (inst73_out, inst67_q);
  DFF inst72 (.CLK(clk), .D(inst67_q), .Q(inst72_q));  // open: CLRN, PRN
  assign g = gKonacno & {4{disp_en}};  // AND2 inst19, 4 bits wide
  assign b = bKonacno & {4{disp_en}};  // AND2 inst20, 4 bits wide
  KokoskaSaJajima inst24 (
    .Xpoc(konst11_290), .Ypoc(konst10_20), .X(vga_x), .Y(vga_y), .pogodjena(dkok4), .start(start), .clk(clk),
    .unisteno_jaje1(djaje4), .unisteno_jaje2(djaje4d), .R(Rk4), .G(Gk4), .B(Bk4), .kokoska(kok4),
    .jaje1(kok4jaje1), .jaje2(kok4jaje2), .Rj(Rj4), .Gj(Gj4), .Bj(Bj4));  // open: aktivno_jaje1, aktivno_jaje2, T0
  KokoskaSaJajima inst42 (
    .Xpoc(konst11_335), .Ypoc(konst10_100), .X(vga_x), .Y(vga_y), .pogodjena(dkok12), .start(start),
    .clk(clk), .unisteno_jaje1(djaje12), .unisteno_jaje2(djaje12d), .R(Rk12), .G(Gk12), .B(Bk12),
    .kokoska(kok12), .jaje1(kok12jaje1), .jaje2(kok12jaje2), .Rj(Rj12), .Gj(Gj12), .Bj(Bj12));  // open: aktivno_jaje1, aktivno_jaje2, T0
  and inst74 (ispali, inst73_out, inst72_q);
  MP2X #(.size(4)) inst83 (.X0(inst84_y), .X1(Rj1), .S(jaje1), .Y(r1Konacno));
  MP2X #(.size(4)) inst81 (.X0(inst86_y), .X1(Gj1), .S(jaje1), .Y(g1Konacno));
  MP2X #(.size(4)) inst82 (.X0(inst88_y), .X1(Bj1), .S(jaje1), .Y(b1Konacno));
  CONSTX #(.size(11), .\const (290)) inst11 (.data(konst11_290));
  CONSTX #(.size(11), .\const (335)) inst50 (.data(konst11_335));
  Raketa inst75 (
    .X(vga_x[9:0]), .Y(vga_y), .X_LEVIKRAJ(XLEVIKRAJBRODA), .CLK(clk), .PUCAJ(ispali), .DestroyR0(drak1),
    .DestroyR1(drak2), .DestroyR2(drak3), .DestroyR3(drak4), .DestroyR4(drak5), .R(RRakete), .G(GRakete),
    .B(BRakete), .valid0(rak1), .valid1(rak2), .valid2(rak3), .valid3(rak4), .valid4(rak5));
  KokoskaSaJajima inst25 (
    .Xpoc(konst11_380), .Ypoc(konst10_20), .X(vga_x), .Y(vga_y), .pogodjena(dkok5), .start(start), .clk(clk),
    .unisteno_jaje1(djaje5), .unisteno_jaje2(djaje5d), .R(Rk5), .G(Gk5), .B(Bk5), .kokoska(kok5),
    .jaje1(kok5jaje1), .jaje2(kok5jaje2), .Rj(Rj5), .Gj(Gj5), .Bj(Bj5));  // open: aktivno_jaje1, aktivno_jaje2, T0
  KokoskaSaJajima inst43 (
    .Xpoc(konst11_425), .Ypoc(konst10_100), .X(vga_x), .Y(vga_y), .pogodjena(dkok13), .start(start),
    .clk(clk), .unisteno_jaje1(djaje13), .unisteno_jaje2(djaje13d), .R(Rk13), .G(Gk13), .B(Bk13),
    .kokoska(kok13), .jaje1(kok13jaje1), .jaje2(kok13jaje2), .Rj(Rj13), .Gj(Gj13), .Bj(Bj13));  // open: aktivno_jaje1, aktivno_jaje2, T0
  REGX #(.size(8), .default_value(0)) inst323 (
    .clk(clk), .cl(start), .inc(uvecaj), .data_out(rez));  // open: ld, dec, data_in
  seven_segment_digit_interface inst340 (
    .x3(rez[3]), .x2(rez[2]), .x1(rez[1]), .x0(rez[0]), .dot(1'b0), .en(1'b1), .a(aleksa), .b(uros),
    .c(teodora), .d(filip), .e(aca), .f(sandra), .g(jana));  // open: dp
  and inst18 (kok1rak1, kok1, rak1);
  and inst79 (kok1rak2, kok1, rak2);
  and inst80 (kok1rak3, kok1, rak3);
  and inst180 (kok1rak4, kok1, rak4);
  and inst181 (kok1rak5, kok1, rak5);
  or inst252 (dkok1, kok1rak1, kok1rak2, kok1rak3, kok1rak4, kok1rak5);
  or inst253 (dkok2, kok2rak1, kok2rak2, kok2rak3, kok2rak4, kok2rak5);
  or inst254 (dkok3, kok3rak1, kok3rak2, kok3rak3, kok3rak4, kok3rak5);
  or inst255 (dkok4, kok4rak1, kok4rak2, kok4rak3, kok4rak4, kok4rak5);
  or inst256 (dkok5, kok5rak1, kok5rak2, kok5rak3, kok5rak4, kok5rak5);
  or inst257 (dkok6, kok6rak1, kok6rak2, kok6rak3, kok6rak4, kok6rak5);
  or inst258 (dkok7, kok7rak1, kok7rak2, kok7rak3, kok7rak4, kok7rak5);
  or inst259 (dkok8, kok8rak1, kok8rak2, kok8rak3, kok8rak4, kok8rak5);
  or inst260 (dkok9, kok9rak1, kok9rak2, kok9rak3, kok9rak4, kok9rak5);
  or inst261 (dkok10, kok10rak1, kok10rak2, kok10rak3, kok10rak4, kok10rak5);
  or inst262 (dkok11, kok11rak1, kok11rak2, kok11rak3, kok11rak4, kok11rak5);
  or inst263 (dkok12, kok12rak1, kok12rak2, kok12rak3, kok12rak4, kok12rak5);
  or inst264 (dkok13, kok13rak1, kok13rak2, kok13rak3, kok13rak4, kok13rak5);
  or inst265 (dkok14, kok14rak1, kok14rak2, kok14rak3, kok14rak4, kok14rak5);
  or inst266 (dkok15, kok15rak1, kok15rak2, kok15rak3, kok15rak4, kok15rak5);
  or inst76 (validRaketa, rak1, rak2, rak3, rak4, rak5);
  not inst300 (pin_name1, kok1rak1);
  CONSTX #(.size(11), .\const (380)) inst36 (.data(konst11_380));
  CONSTX #(.size(11), .\const (425)) inst51 (.data(konst11_425));
  and inst182 (kok2rak1, kok2, rak1);
  and inst183 (kok2rak2, kok2, rak2);
  and inst184 (kok2rak3, kok2, rak3);
  and inst185 (kok2rak4, kok2, rak4);
  and inst186 (kok2rak5, kok2, rak5);
  or inst267 (inst267_out, kok1rak2, kok2rak2, kok3rak2, kok4rak2, kok5rak2, kok6rak2, kok7rak2, kok8rak2, kok9rak2, kok10rak2, kok11rak2, kok12rak2);
  or inst270 (inst270_out, kok1rak1, kok2rak1, kok3rak1, kok4rak1, kok5rak1, kok6rak1, kok7rak1, kok8rak1, kok9rak1, kok10rak1, kok11rak1, kok12rak1);
  or inst271 (inst271_out, kok13rak1, kok14rak1, kok15rak1);
  or inst273 (inst273_out, kok1rak3, kok2rak3, kok3rak3, kok4rak3, kok5rak3, kok6rak3, kok7rak3, kok8rak3, kok9rak3, kok10rak3, kok11rak3, kok12rak3);
  or inst274 (inst274_out, kok13rak3, kok14rak3, kok15rak3);
  or inst276 (inst276_out, kok1rak4, kok2rak4, kok3rak4, kok4rak4, kok5rak4, kok6rak4, kok7rak4, kok8rak4, kok9rak4, kok10rak4, kok11rak4, kok12rak4);
  or inst277 (inst277_out, kok13rak4, kok14rak4, kok15rak4);
  or inst279 (inst279_out, kok1rak5, kok2rak5, kok3rak5, kok4rak5, kok5rak5, kok6rak5, kok7rak5, kok8rak5, kok9rak5, kok10rak5, kok11rak5, kok12rak5);
  or inst280 (inst280_out, kok13rak5, kok14rak5, kok15rak5);
  or inst268 (inst268_out, kok13rak2, kok14rak2, kok15rak2);
  KokoskaSaJajima inst44 (
    .Xpoc(konst11_515), .Ypoc(konst10_100), .X(vga_x), .Y(vga_y), .pogodjena(dkok14), .start(start),
    .clk(clk), .unisteno_jaje1(djaje14), .unisteno_jaje2(djaje14d), .R(Rk14), .G(Gk14), .B(Bk14),
    .kokoska(kok14), .jaje1(kok14jaje1), .jaje2(kok14jaje2), .Rj(Rj14), .Gj(Gj14), .Bj(Bj14));  // open: aktivno_jaje1, aktivno_jaje2, T0
  Brod inst12 (
    .CLK(clk), .start(start), .X(vga_x[9:0]), .Y(vga_y), .BUTTON_LEVO(LEFT), .BUTTON_DESNO(RIGHT),
    .DestroyB(dBrod), .valid(brod), .X_LEVIKRAJ(XLEVIKRAJBRODA), .R(RBrod), .G(GBrod), .B(BBrod));  // open: pin_name1
  and inst187 (kok3rak1, kok3, rak1);
  and inst188 (kok3rak2, kok3, rak2);
  and inst189 (kok3rak3, kok3, rak3);
  and inst190 (kok3rak4, kok3, rak4);
  and inst191 (kok3rak5, kok3, rak5);
  KokoskaSaJajima inst26 (
    .Xpoc(konst11_470), .Ypoc(konst10_20), .X(vga_x), .Y(vga_y), .pogodjena(dkok6), .start(start), .clk(clk),
    .unisteno_jaje1(djaje6), .unisteno_jaje2(djaje6d), .R(Rk6), .G(Gk6), .B(Bk6), .kokoska(kok6),
    .jaje1(kok6jaje1), .jaje2(kok6jaje2), .Rj(Rj6), .Gj(Gj6), .Bj(Bj6));  // open: aktivno_jaje1, aktivno_jaje2, T0
  or inst269 (drak2, inst267_out, inst268_out);
  or inst272 (drak1, inst270_out, inst271_out);
  or inst275 (drak3, inst273_out, inst274_out);
  or inst278 (drak4, inst276_out, inst277_out);
  or inst281 (drak5, inst279_out, inst280_out);
  seven_segment_digit_interface inst342 (
    .x3(rez[7]), .x2(rez[6]), .x1(rez[5]), .x0(rez[4]), .dot(1'b0), .en(1'b1), .a(aleksa1), .b(uros1),
    .c(teodora1), .d(filip1), .e(aca1), .f(sandra1), .g(jana1));  // open: dp
  CONSTX #(.size(11), .\const (515)) inst52 (.data(konst11_515));
  and inst192 (kok4rak1, kok4, rak1);
  and inst193 (kok4rak2, kok4, rak2);
  and inst194 (kok4rak3, kok4, rak3);
  and inst195 (kok4rak4, kok4, rak4);
  and inst196 (kok4rak5, kok4, rak5);
  CONSTX #(.size(11), .\const (470)) inst37 (.data(konst11_470));
  or inst324 (uvecaj, drak1, drak2, drak3, drak4, drak5);
  and inst282 (djaje1, kok1jaje1, brod);
  and inst283 (djaje2, kok2jaje1, brod);
  and inst284 (djaje3, kok3jaje1, brod);
  and inst285 (djaje4, kok4jaje1, brod);
  and inst286 (djaje5, kok5jaje1, brod);
  and inst287 (djaje6, kok6jaje1, brod);
  and inst288 (djaje7, kok7jaje1, brod);
  and inst289 (djaje8, kok8jaje1, brod);
  and inst290 (djaje9, kok9jaje1, brod);
  and inst291 (djaje10, kok10jaje1, brod);
  and inst292 (djaje11, kok11jaje1, brod);
  and inst293 (djaje12, kok12jaje1, brod);
  and inst294 (djaje13, kok13jaje1, brod);
  and inst295 (djaje14, kok14jaje1, brod);
  and inst296 (djaje15, kok15jaje1, brod);
  and inst301 (djaje1d, kok1jaje2, brod);
  and inst302 (djaje2d, kok2jaje2, brod);
  and inst303 (djaje3d, kok3jaje2, brod);
  and inst304 (djaje4d, kok4jaje2, brod);
  and inst305 (djaje5d, kok5jaje2, brod);
  and inst306 (djaje6d, kok6jaje2, brod);
  and inst307 (djaje7d, kok7jaje2, brod);
  and inst308 (djaje8d, kok8jaje2, brod);
  and inst309 (djaje9d, kok9jaje2, brod);
  and inst310 (djaje10d, kok10jaje2, brod);
  and inst311 (djaje11d, kok11jaje2, brod);
  and inst312 (djaje12d, kok12jaje2, brod);
  and inst313 (djaje13d, kok13jaje2, brod);
  and inst314 (djaje14d, kok14jaje2, brod);
  and inst315 (djaje15d, kok15jaje2, brod);
  and inst197 (kok6rak1, kok6, rak1);
  and inst198 (kok6rak2, kok6, rak2);
  and inst199 (kok6rak3, kok6, rak3);
  and inst200 (kok6rak4, kok6, rak4);
  and inst201 (kok6rak5, kok6, rak5);
  KokoskaSaJajima inst27 (
    .Xpoc(konst11_560), .Ypoc(konst10_20), .X(vga_x), .Y(vga_y), .pogodjena(dkok7), .start(start), .clk(clk),
    .unisteno_jaje1(djaje7), .unisteno_jaje2(djaje7d), .R(Rk7), .G(Gk7), .B(Bk7), .kokoska(kok7),
    .jaje1(kok7jaje1), .jaje2(kok7jaje2), .Rj(Rj7), .Gj(Gj7), .Bj(Bj7));  // open: aktivno_jaje1, aktivno_jaje2, T0
  KokoskaSaJajima inst45 (
    .Xpoc(konst11_605), .Ypoc(konst10_100), .X(vga_x), .Y(vga_y), .pogodjena(dkok15), .start(start),
    .clk(clk), .unisteno_jaje1(djaje15), .unisteno_jaje2(djaje15d), .R(Rk15), .G(Gk15), .B(Bk15),
    .kokoska(kok15), .jaje1(kok15jaje1), .jaje2(kok15jaje2), .Rj(Rj15), .Gj(Gj15), .Bj(Bj15));  // open: aktivno_jaje1, aktivno_jaje2, T0
  CONSTX #(.size(11), .\const (560)) inst38 (.data(konst11_560));
  CONSTX #(.size(11), .\const (605)) inst53 (.data(konst11_605));
  and inst202 (kok7rak1, kok7, rak1);
  and inst203 (kok7rak2, kok7, rak2);
  and inst204 (kok7rak3, kok7, rak3);
  and inst205 (kok7rak4, kok7, rak4);
  and inst206 (kok7rak5, kok7, rak5);
  or inst297 (inst297_out, djaje1, djaje2, djaje3, djaje4, djaje5, djaje6, djaje7, djaje8, djaje9, djaje10, djaje11, djaje12);
  or inst316 (inst316_out, djaje1d, djaje2d, djaje3d, djaje4d, djaje5d, djaje6d, djaje7d, djaje8d, djaje9d, djaje10d, djaje11d, djaje12d);
  and inst207 (kok8rak1, kok8, rak1);
  and inst208 (kok8rak2, kok8, rak2);
  and inst209 (kok8rak3, kok8, rak3);
  and inst210 (kok8rak4, kok8, rak4);
  and inst211 (kok8rak5, kok8, rak5);
  or inst298 (inst298_out, djaje13, djaje14, djaje15);
  or inst317 (inst317_out, djaje13d, djaje14d, djaje15d);
  CONSTX #(.size(11), .\const (695)) inst54 (.data(konst11_695));
  KokoskaSaJajima inst28 (
    .Xpoc(konst11_650), .Ypoc(konst10_20), .X(vga_x), .Y(vga_y), .pogodjena(dkok8), .start(start), .clk(clk),
    .unisteno_jaje1(djaje8), .unisteno_jaje2(djaje8d), .R(Rk8), .G(Gk8), .B(Bk8), .kokoska(kok8),
    .jaje1(kok8jaje1), .jaje2(kok8jaje2), .Rj(Rj8), .Gj(Gj8), .Bj(Bj8));  // open: aktivno_jaje1, aktivno_jaje2, T0
  or inst299 (inst299_out, inst297_out, inst298_out);
  or inst318 (inst318_out, inst316_out, inst317_out);
  CONSTX #(.size(11), .\const (650)) inst39 (.data(konst11_650));
  and inst212 (kok9rak1, kok9, rak1);
  and inst213 (kok9rak2, kok9, rak2);
  and inst214 (kok9rak3, kok9, rak3);
  and inst215 (kok9rak4, kok9, rak4);
  and inst216 (kok9rak5, kok9, rak5);
  or inst77 (dBrod, inst299_out, inst318_out);
  and inst217 (kok10rak1, kok10, rak1);
  and inst218 (kok10rak2, kok10, rak2);
  and inst219 (kok10rak3, kok10, rak3);
  and inst220 (kok10rak4, kok10, rak4);
  and inst221 (kok10rak5, kok10, rak5);
  and inst222 (kok11rak1, kok11, rak1);
  and inst223 (kok11rak2, kok11, rak2);
  and inst224 (kok11rak3, kok11, rak3);
  and inst225 (kok11rak4, kok11, rak4);
  and inst226 (kok11rak5, kok11, rak5);
  and inst227 (kok12rak1, kok12, rak1);
  and inst228 (kok12rak2, kok12, rak2);
  and inst229 (kok12rak3, kok12, rak3);
  and inst230 (kok12rak4, kok12, rak4);
  and inst231 (kok12rak5, kok12, rak5);
  and inst232 (kok13rak1, kok13, rak1);
  and inst233 (kok13rak2, kok13, rak2);
  and inst234 (kok13rak3, kok13, rak3);
  and inst235 (kok13rak4, kok13, rak4);
  and inst236 (kok13rak5, kok13, rak5);
  and inst237 (kok14rak1, kok14, rak1);
  and inst238 (kok14rak2, kok14, rak2);
  and inst239 (kok14rak3, kok14, rak3);
  and inst240 (kok14rak4, kok14, rak4);
  and inst241 (kok14rak5, kok14, rak5);
  and inst242 (kok15rak1, kok15, rak1);
  and inst243 (kok15rak2, kok15, rak2);
  and inst244 (kok15rak3, kok15, rak3);
  and inst245 (kok15rak4, kok15, rak4);
  and inst246 (kok15rak5, kok15, rak5);
  and inst247 (kok5rak1, kok5, rak1);
  and inst248 (kok5rak2, kok5, rak2);
  and inst249 (kok5rak3, kok5, rak3);
  and inst250 (kok5rak4, kok5, rak4);
  and inst251 (kok5rak5, kok5, rak5);

  // Notes on the sheet:
  //   Generisanje konacnog R,G,B 
  //   INTERAKCIJE BRODA I JAJETA
  //   INTERAKCIJE BRODA I JAJETA
endmodule
